# EAGLE schematic Prototype Schematic (EAGLE 7.7.0)
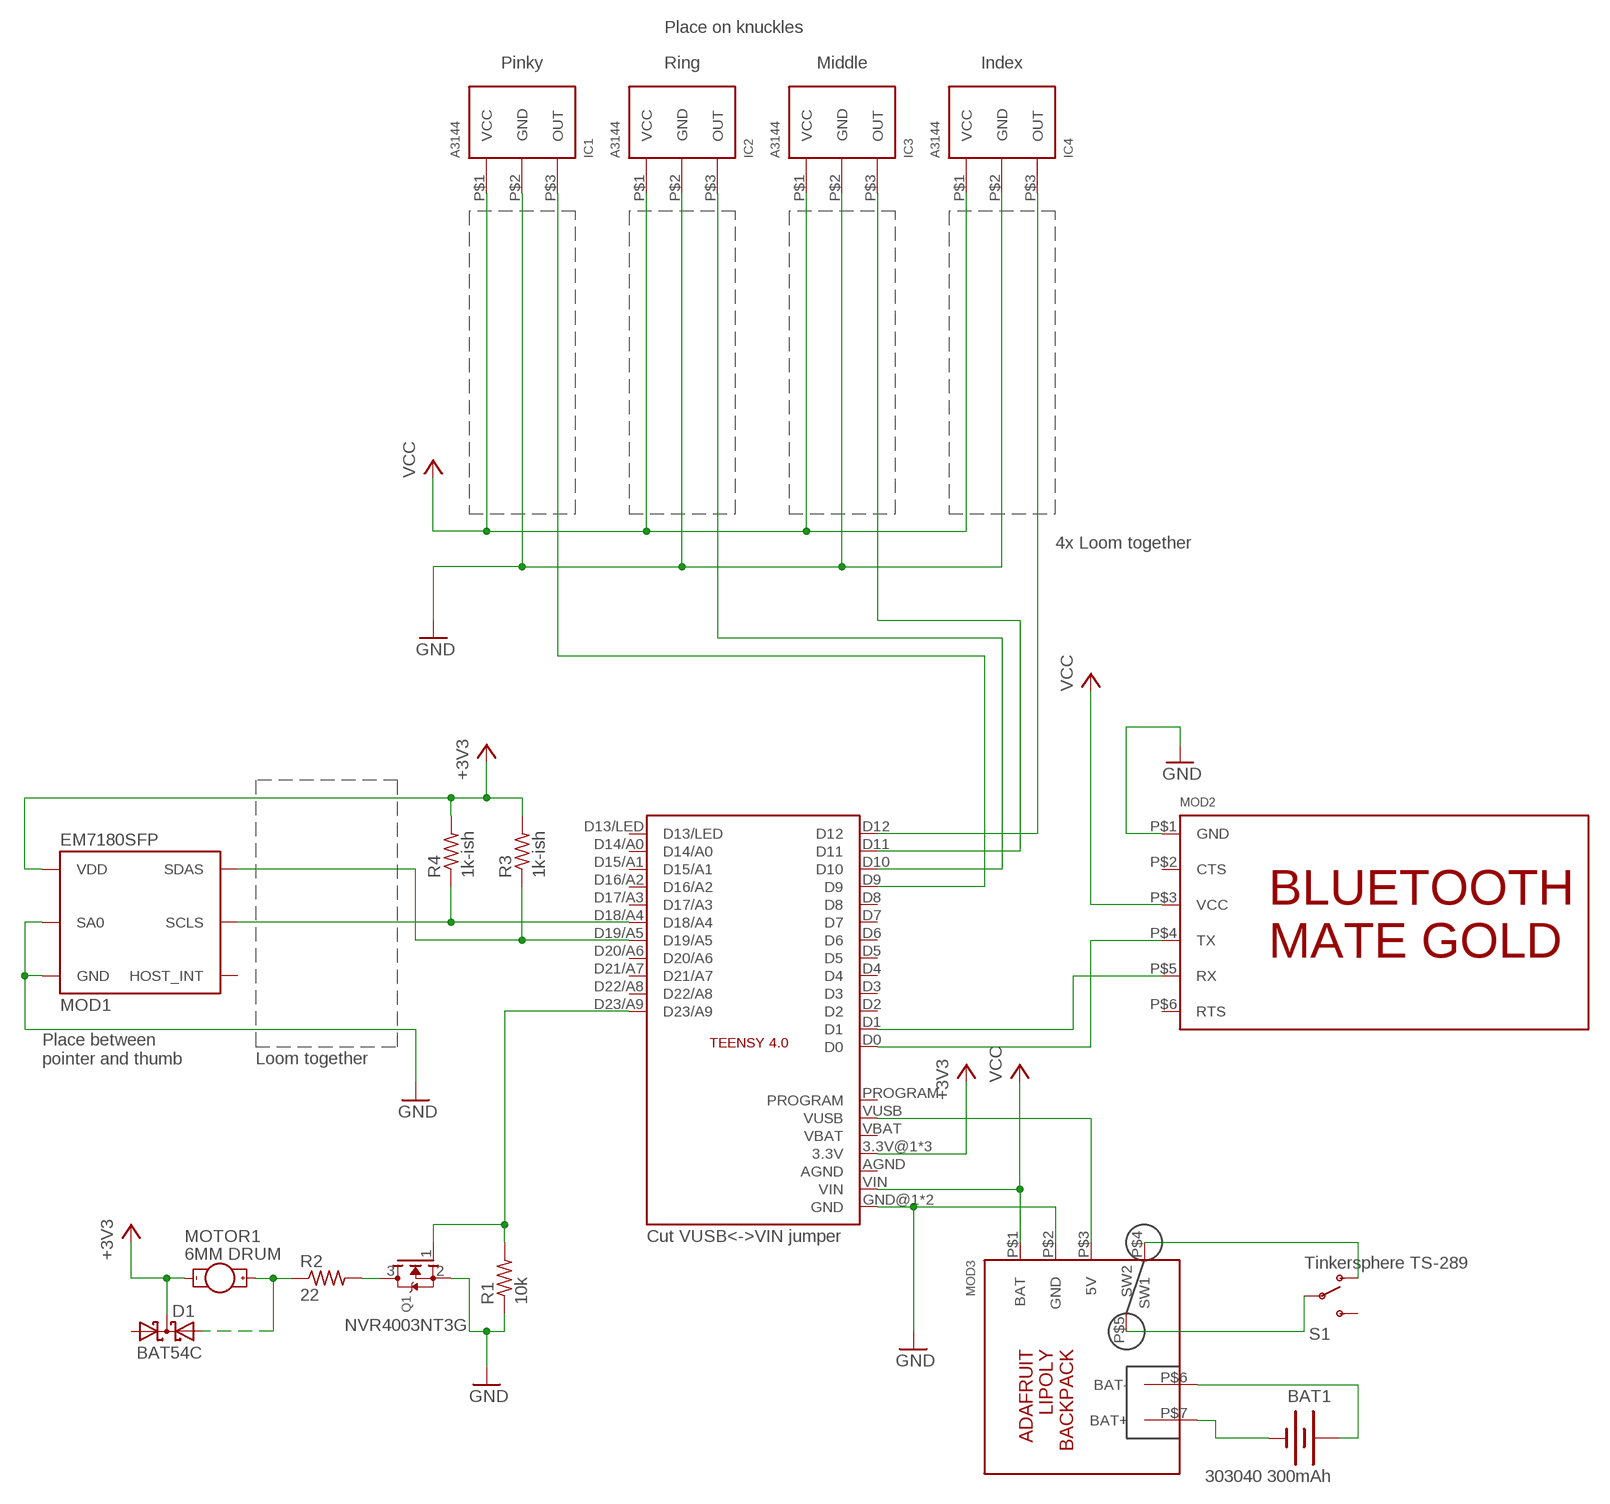
[diagram p0: schematic, sheet 1]

## Parts
BAT1  303040 300mAh  BATTERYLIPO-TABS  [LIPO-110-TABS]
D1  BAT54C  [SOT23]
IC1  A3144  A314  [DUMMY-PIN]
IC2  A3144  A314  [DUMMY-PIN]
IC3  A3144  A314  [DUMMY-PIN]
IC4  A3144  A314  [DUMMY-PIN]
MOD1  EM7180SFP  [EM7180SFP]
MOD2  BLUETOOTH-MATE-GOLD  [DUMMY-PIN]
MOD3  LIPOLY-BACKPACK  [DUMMY-PIN]
MOTOR1  6MM DRUM  MOTOR10MM  [VIBE-MOTOR-10MM]
Q1  MOSFET-NREFLOW  [SOT23]
R1  10k  R-US_R0603  [R0603]
R2  22  R-US_R0603  [R0603]
R3  1k-ish  R-US_R0603  [R0603]
R4  1k-ish  R-US_R0603  [R0603]
S1  Tinkersphere TS-289  SWITCH-SPDTPTH  [SWITCH-SPDT]
U$1  TEENSY4.0  [TEENSY4.0]

## Nets
+3V3: D1.3(CC) MOD1.P$1(VDD) MOTOR1.- R3.2 R4.2 U$1.3.3V@1(3.3V) U$1.3.3V@2(3.3V) U$1.ON/OFF(3.3V)
GND: IC1.P$2(GND) IC2.P$2(GND) IC3.P$2(GND) IC4.P$2(GND) MOD1.P$5(SA0) MOD1.P$6(GND) MOD2.P$1(GND) MOD3.P$2(GND) Q1.2(S) R1.1 U$1.GND@1(GND) U$1.GND@2(GND)
N$1: MOD1.P$3(SCLS) R4.1 U$1.D18/A4
N$2: MOD1.P$2(SDAS) R3.1 U$1.D19/A5
N$5: Q1.1(G) R1.2 U$1.D23/A9
N$7: D1.2(A2) MOTOR1.+ R2.1
N$8: Q1.3(D) R2.2
N$10: MOD3.P$5(SW2) S1.2(P)
N$11: MOD3.P$4(SW1) S1.1(O)
N$12: BAT1.- MOD3.P$7(BAT+)
N$13: BAT1.+ MOD3.P$6(BAT-)
N$14: MOD2.P$4(TX) U$1.D0
N$15: MOD2.P$5(RX) U$1.D1
N$16: MOD3.P$3(5V) U$1.VUSB
N$18: IC4.P$3(OUT) U$1.D12
N$20: IC3.P$3(OUT) U$1.D11
N$21: IC2.P$3(OUT) U$1.D10
N$22: IC1.P$3(OUT) U$1.D9
VCC: IC1.P$1(VCC) IC2.P$1(VCC) IC3.P$1(VCC) IC4.P$1(VCC) MOD2.P$3(VCC) MOD3.P$1(BAT) U$1.VIN
Unconnected: D1.1(A1) MOD1.P$4(HOST_INT) MOD2.P$2(CTS) MOD2.P$6(RTS) S1.3(S) U$1.AGND U$1.D2 U$1.D3 U$1.D4 U$1.D5 U$1.D6 U$1.D7 U$1.D8 U$1.D13/LED U$1.D14/A0 U$1.D15/A1 U$1.D16/A2 U$1.D17/A3 U$1.D20/A6 U$1.D21/A7 U$1.D22/A8 U$1.PROGRAM U$1.VBAT

## Notes on the sheet
- Place on knuckles
- Pinky | Ring | Middle | Index
- 4x Loom together
- Place between
  pointer and thumb
- Loom together
- Cut VUSB<->VIN jumper
- NVR4003NT3G

## Library data of the parts
BAT1 = SparkFun-Electromechanical:BATTERY: Battery Holders Various common sizes : AA, AAA, 20mm coin cell and 12mm coin cell. 20MM_4LEGS, BATT-10373
D1 = diode:BAT54C: Schottky Diodes Source: Fairchild .. BAT54.pdf
IC1-IC4 = Voidstar-Dummy:A314*
MOD1 = Voidstar-Exotic:EM7180SFP: EM7180SFP Sensor fusion platform module. Incorporated EM7180 Sentral Hub coprocessor, Bosch BMX055 9-DOF IMU, and ST24256 32KB EEPROM. Axes are indicated on the tDocu layer. Decoupling caps are included on module. I2C pullups needed.
MOD2 = Voidstar-Dummy:BLUETOOTH-MATE-GOLD
MOD3 = Voidstar-Dummy:LIPOLY-BACKPACK
MOTOR1 = SparkFun-Electromechanical:MOTOR: Vibration Motor- ROB-08449 Physical dimension and wire connections for this powerful vibration motor. Motor has a self adhesive backing.
Q1 = adafruit:MOSFET-N: N-Channel Mosfet 2N7002E - 60V 260mA SOT23 [Digikey: 2N7002ET1GOSTR-ND] - REEL BSH103 - 30V 850mA SOT23 [Digikey: 568-5013-1-ND]
R1-R4 = rcl:R-US_: RESISTOR, American symbol
S1 = SparkFun-Electromechanical:SWITCH-SPDT: SPDT Switch Simple slide switch, Spark Fun Electronics SKU : COM-00102 DPDT SMT slide switch, AYZ0202, SWCH-08179
U$1 = Teensy4.0:TEENSY4.0